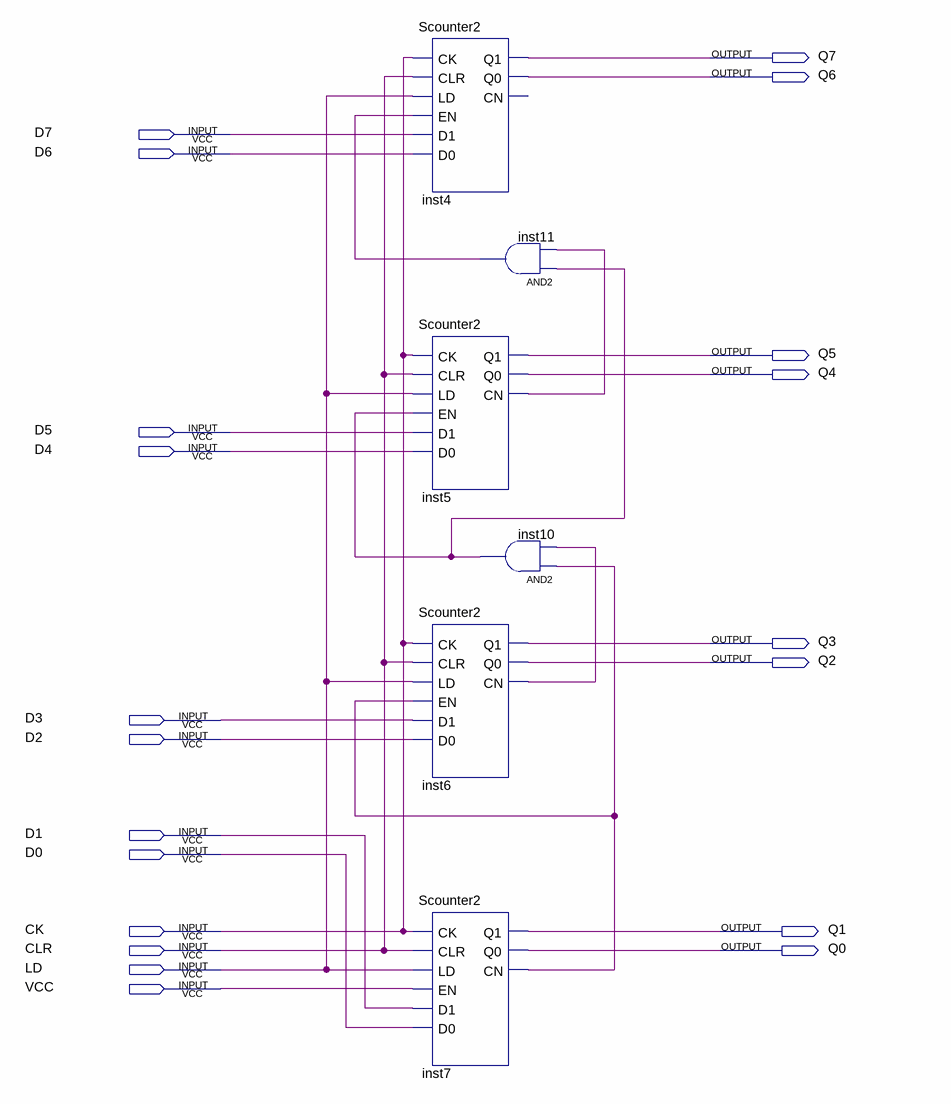
[diagram p0: schematic sheet]
// Quartus schematic Scounter8.bdf as structural Verilog: 6 symbols, 20 pins
module Scounter8 (
  input  D7,
  input  D6,
  input  D5,
  input  D4,
  input  D3,
  input  D2,
  input  D1,
  input  D0,
  input  CK,
  input  CLR,
  input  LD,
  input  VCC,
  output Q7,
  output Q6,
  output Q5,
  output Q4,
  output Q3,
  output Q2,
  output Q1,
  output Q0
);

  wire inst5_cn, inst6_cn, inst7_cn, inst10_out, inst11_out;

  Scounter2 inst4 (.CK(CK), .CLR(CLR), .LD(LD), .EN(inst11_out), .D1(D7), .D0(D6), .Q1(Q7), .Q0(Q6));  // open: CN
  Scounter2 inst5 (.CK(CK), .CLR(CLR), .LD(LD), .EN(inst10_out), .D1(D5), .D0(D4), .Q1(Q5), .Q0(Q4), .CN(inst5_cn));
  Scounter2 inst6 (.CK(CK), .CLR(CLR), .LD(LD), .EN(inst7_cn), .D1(D3), .D0(D2), .Q1(Q3), .Q0(Q2), .CN(inst6_cn));
  Scounter2 inst7 (.CK(CK), .CLR(CLR), .LD(LD), .EN(VCC), .D1(D1), .D0(D0), .Q1(Q1), .Q0(Q0), .CN(inst7_cn));
  and inst11 (inst11_out, inst10_out, inst5_cn);
  and inst10 (inst10_out, inst7_cn, inst6_cn);
endmodule
